# EAGLE design RpiWeatherStationBoard (EAGLE 6.5.0)
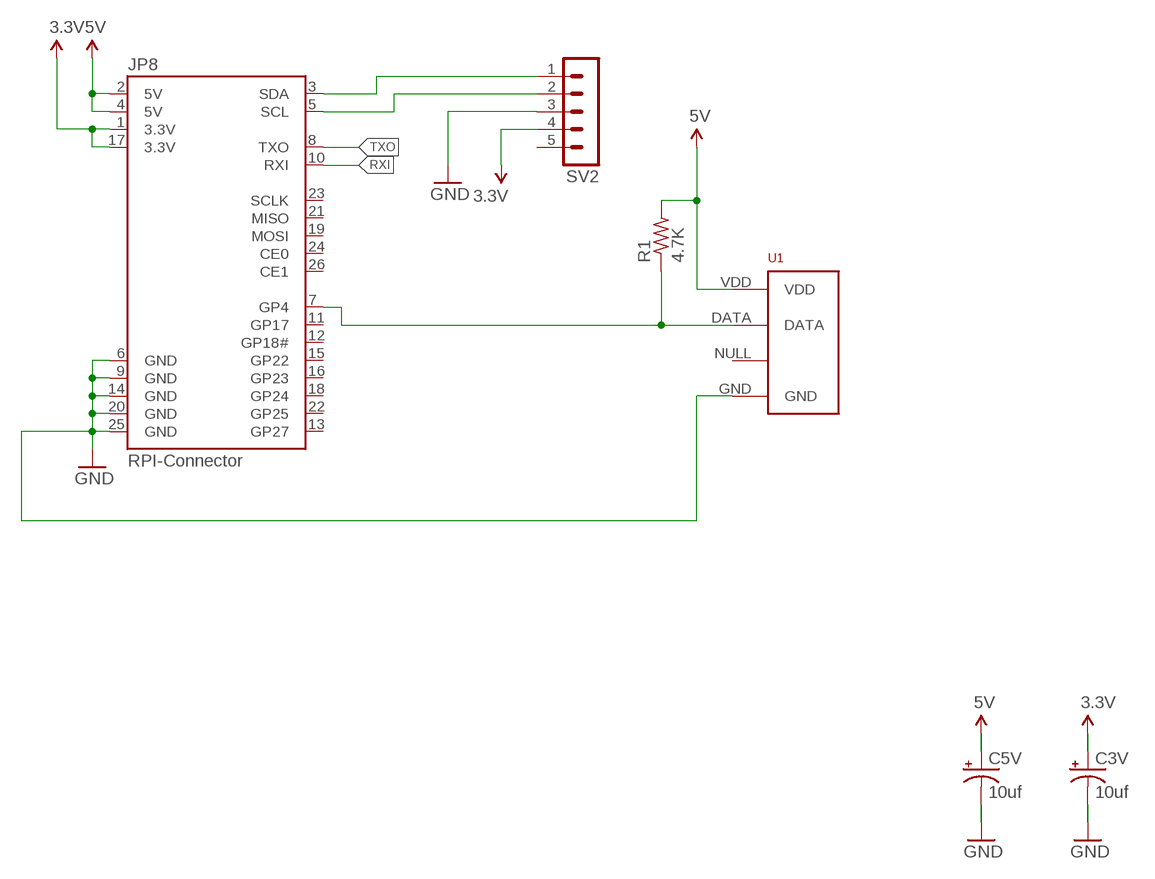
[diagram p0: schematic, sheet 1]

## Parts
C3V  10uf  10UF-25V-20%(PTH)KIT  [CPOL-RADIAL-10UF-25V-KIT]
C5V  10uf  10UF-25V-20%(PTH)KIT  [CPOL-RADIAL-10UF-25V-KIT]
JP8  RPI-Connector  RASPBERRYPI-GPIOPTH  [2X13-SHROUDED]
R1  4.7K  R-US_0207/10  [0207/10]
SV2  MA05-1  [MA05-1]
U1  RHT03_DHT-22_AM2302WIRED  [AM2302]

## Nets
3.3V: C3V.1(+) JP8.1(3.3V) JP8.17(3.3V) SV2.4
5V: C5V.1(+) JP8.2(5V) JP8.4(5V) R1.2 U1.VDD
GND: C3V.2(-) C5V.2(-) JP8.6(GND) JP8.9(GND) JP8.14(GND) JP8.20(GND) JP8.25(GND) SV2.3 U1.GND
N$1: JP8.3(SDA) SV2.1
N$2: JP8.7(GP4) R1.1 U1.DATA
N$3: JP8.5(SCL) SV2.2
RXI: JP8.10(RXI)
TXO: JP8.8(TXO)
Unconnected: JP8.11(GP17) JP8.12(GP18#) JP8.13(GP27) JP8.15(GP22) JP8.16(GP23) JP8.18(GP24) JP8.19(MOSI) JP8.21(MISO) JP8.22(GP25) JP8.23(SCLK) JP8.24(CE0) JP8.26(CE1) SV2.5 U1.NULL

## Library data of the parts
C3V C5V = SparkFun-Capacitors:10UF-25V-20%(PTH): CAP-08440; PROD_ID: CAP-08440
JP8 = SparkFun-Boards:RASPBERRYPI-GPIO: RASPBERRY PI I/O HEADER As defined for the Revistion 2 Pi.; DIST: sparkfun; DIST_ID: PRT-11490
R1 = rcl:R-US_: RESISTOR, American symbol
SV2 = con-lstb:MA05-1: PIN HEADER; OC_FARNELL: unknown; OC_NEWARK: unknown
U1 = RHT03_DHT-22_AM2302:RHT03_DHT-22_AM2302: RHT03 / DHT-22 / AM2302 Packages and symbol for the RHT03 / DHT-22 relative humidity and temperature sensor. Note: The AM2302 is a wired version of the DHT-22 which typically requires less clearance and is thus provided as a separate package.; PROD_ID: SEN-10167

## Board
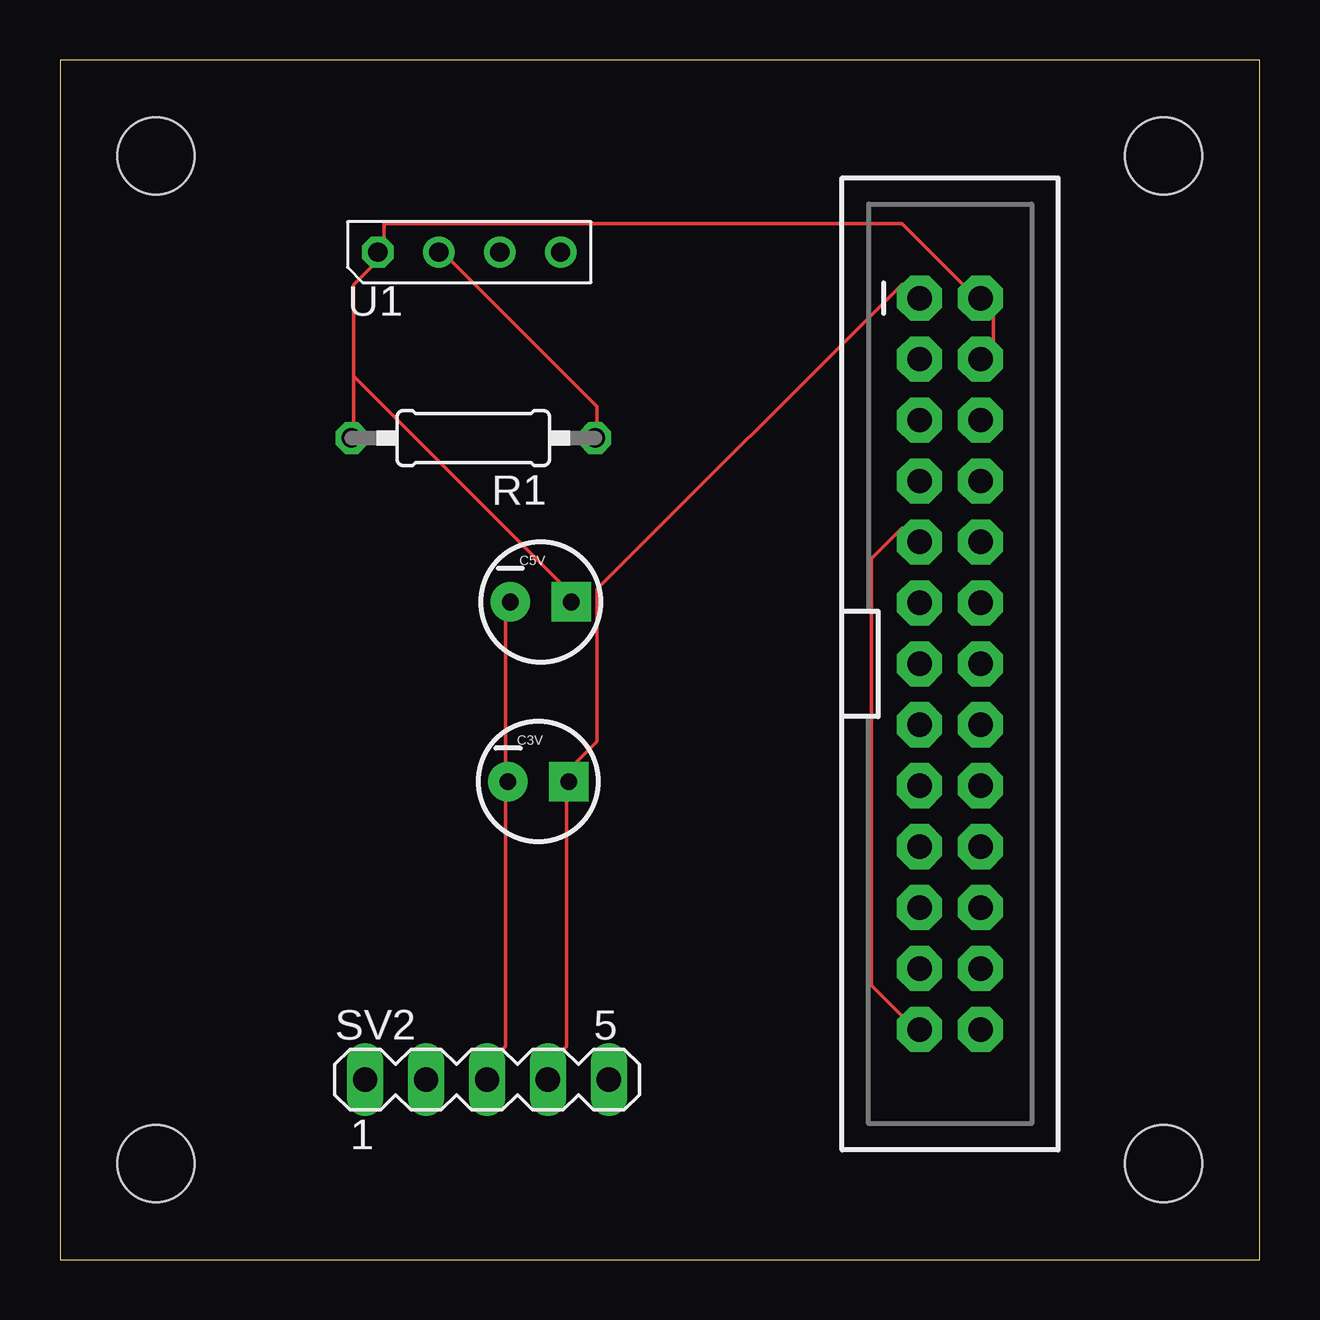
[diagram p1: board, top side]
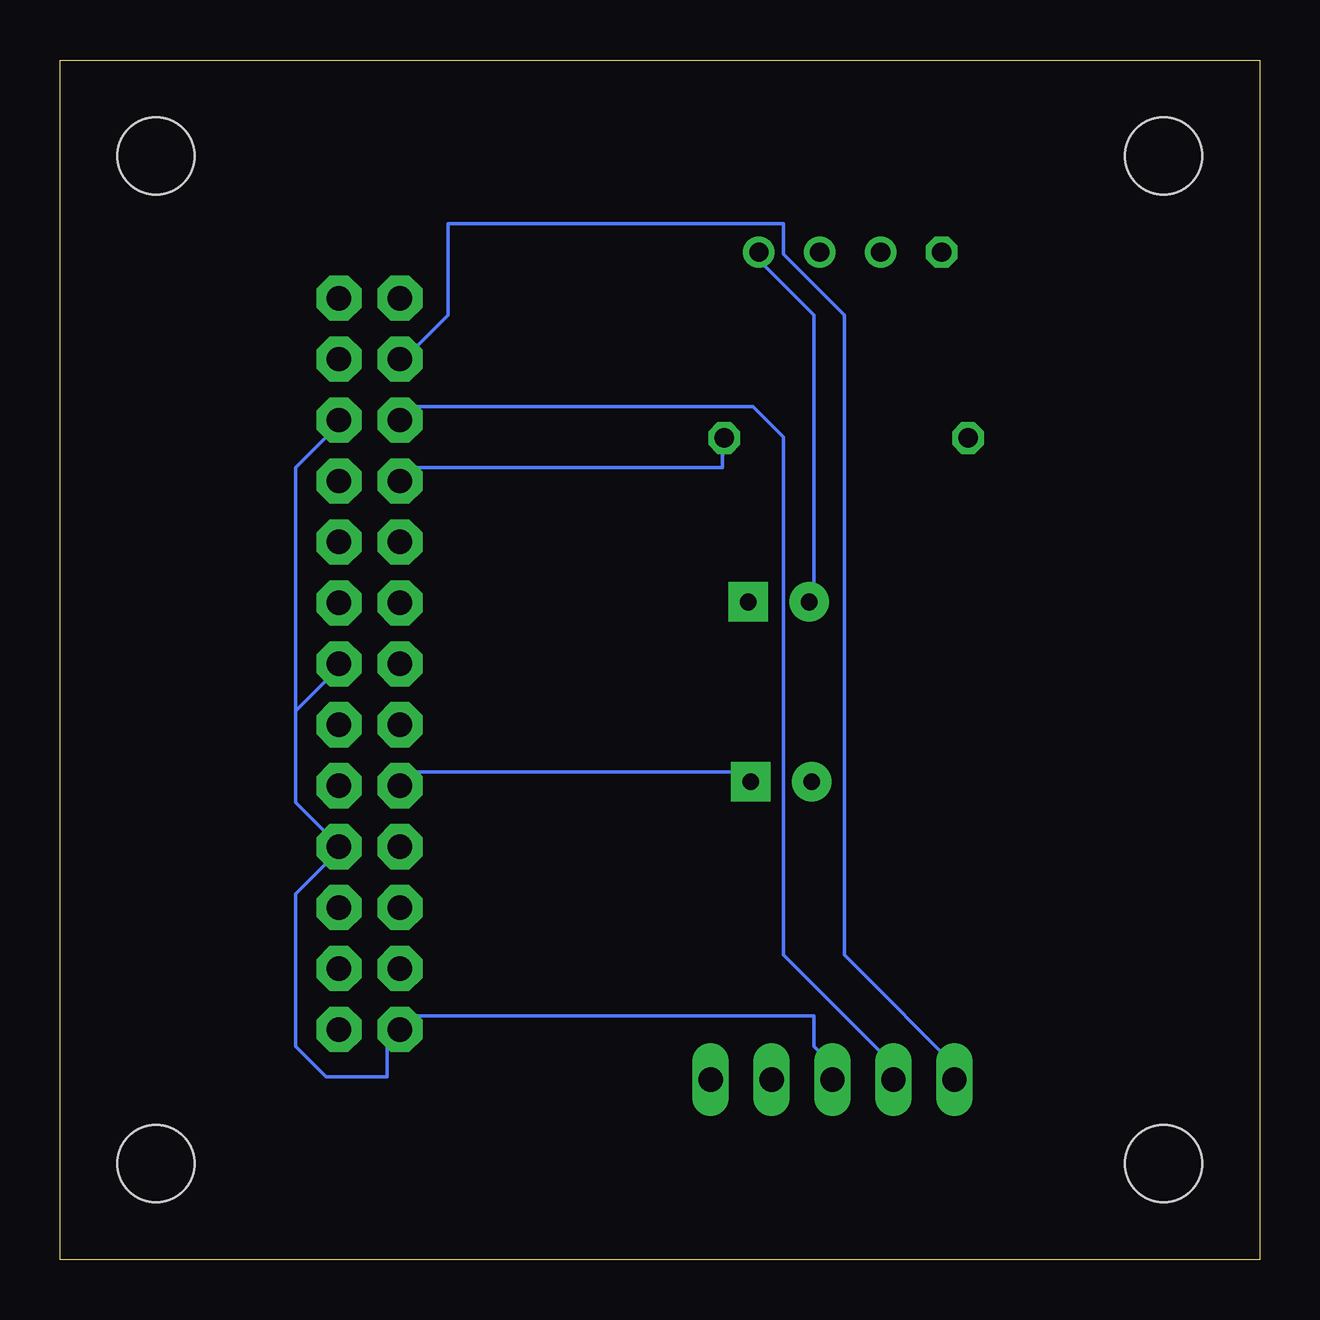
[diagram p2: board, bottom side, seen from below]

Size 50 x 50 mm. Coordinates in mm from the lower left corner, seen from the top.
Outline: 0,0 50,0 50,50 0,50 0,0
Copper layers (1*16): Top 0.035mm / dielectric 1.5mm / Bottom 0.035mm
Design rules "SeeedStudio_2layer_DRU_no_angle_20140221": minimum track width 6mil, minimum drill 12mil, track to track 6mil, track to pad 6mil, pad to pad 6mil, via to via 6mil, smd to smd 0mil, copper to edge 10mil, drill to drill 10mil, minimum pad ring 10mil, minimum via ring 6mil, stop-mask expansion 2mil, vias tented up to drill 100mil, thermal gap 10mil
Holes 3.2 mm at 4,4 4,46 46,4 46,46

### Footprints (pad centres in the part's own frame; a part is rotated, then mirrored left to right if it is on the bottom)
CPOL-RADIAL-10UF-25V-KIT = drill 0.7 pad 1.651 square: 1 1.27,0 | drill 0.7 pad 1.651: 2 -1.27,0
2X13-SHROUDED = drill 1.016 pad 1.88 octagon: 1 -1.27,15.24; 2 1.27,15.24; 3 -1.27,12.7; 4 1.27,12.7; 5 -1.27,10.16; 6 1.27,10.16; 7 -1.27,7.62; 8 1.27,7.62; 9 -1.27,5.08; 10 1.27,5.08; 11 -1.27,2.54; 12 1.27,2.54; 13 -1.27,0; 14 1.27,0; 15 -1.27,-2.54; 16 1.27,-2.54; 17 -1.27,-5.08; 18 1.27,-5.08; 19 -1.27,-7.62; 20 1.27,-7.62; 21 -1.27,-10.16; 22 1.27,-10.16; 23 -1.27,-12.7; 24 1.27,-12.7; 25 -1.27,-15.24; 26 1.27,-15.24
0207/10 = drill 0.813 octagon: 1 -5.08,0; 2 5.08,0
MA05-1 = drill 1.016 long: 1 -5.08,0; 2 -2.54,0; 3 0,0; 4 2.54,0; 5 5.08,0
AM2302 = drill 0.8: DATA -1.27,0; GND 3.81,0; NULL 1.27,0 | drill 0.8 octagon: VDD -3.81,0

### Placement (x,y rotation side)
C3V  19.94,19.92 0 top
C5V  20.04,27.41 0 top
JP8  37.1,24.83 0 top
R1  17.23,34.24 180 top
SV2  17.8,7.5 0 top
U1  17.06,41.99 0 top

### Tracks (layer width: path | path; a pad name or v marks a point on that pad's centre or on a via)
3.3V
  Top 0.152: 21.12,20.32 21.12,8.89 19.85,7.62 SV2.4 | 21.12,20.32 22.39,21.59 22.39,27.94 35.09,40.64 JP8.1 | 21.12,20.32 C3V.1
  Bottom 0.152: JP8.17 35.09,20.32 21.12,20.32 C3V.1
5V
  Top 0.152: JP8.4 38.9,38.1 38.9,39.37 JP8.2 37.63,40.64 35.09,43.18 13.5,43.18 13.5,41.91 | 13.5,41.91 12.23,40.64 12.23,36.83 | 12.23,36.83 12.23,34.29 R1.2 | 12.23,36.83 21.12,27.94 C5V.1 | 13.5,41.91 U1.VDD
GND
  Top 0.152: 18.58,20.32 18.58,8.89 17.31,7.62 SV2.3 | JP8.9 35.09,30.48 33.82,29.21 33.82,11.43 35.09,10.16 JP8.25 | 18.58,20.32 18.58,26.67 C5V.2 | 18.58,20.32 C3V.2
  Bottom 0.152: 40.17,22.86 40.17,19.05 38.9,17.78 JP8.20 38.9,16.51 40.17,15.24 40.17,8.89 38.9,7.62 36.36,7.62 36.36,8.89 JP8.25 35.09,10.16 18.58,10.16 18.58,8.89 17.31,7.62 SV2.3 | 40.17,22.86 38.9,24.13 JP8.14 | 40.17,22.86 40.17,33.02 38.9,34.29 JP8.6 | U1.GND 21.12,41.91 18.58,39.37 18.58,27.94 C5V.2
N$1
  Bottom 0.152: SV2.1 12.23,7.62 17.31,12.7 17.31,39.37 19.85,41.91 19.85,43.18 33.82,43.18 33.82,39.37 35.09,38.1 JP8.3
N$2
  Top 0.152: U1.DATA 16.04,41.91 22.39,35.56 22.39,34.29 R1.1
  Bottom 0.152: JP8.7 35.09,33.02 22.39,33.02 22.39,34.29 R1.1
N$3
  Bottom 0.152: SV2.2 14.77,7.62 19.85,12.7 19.85,34.29 21.12,35.56 35.09,35.56 JP8.5